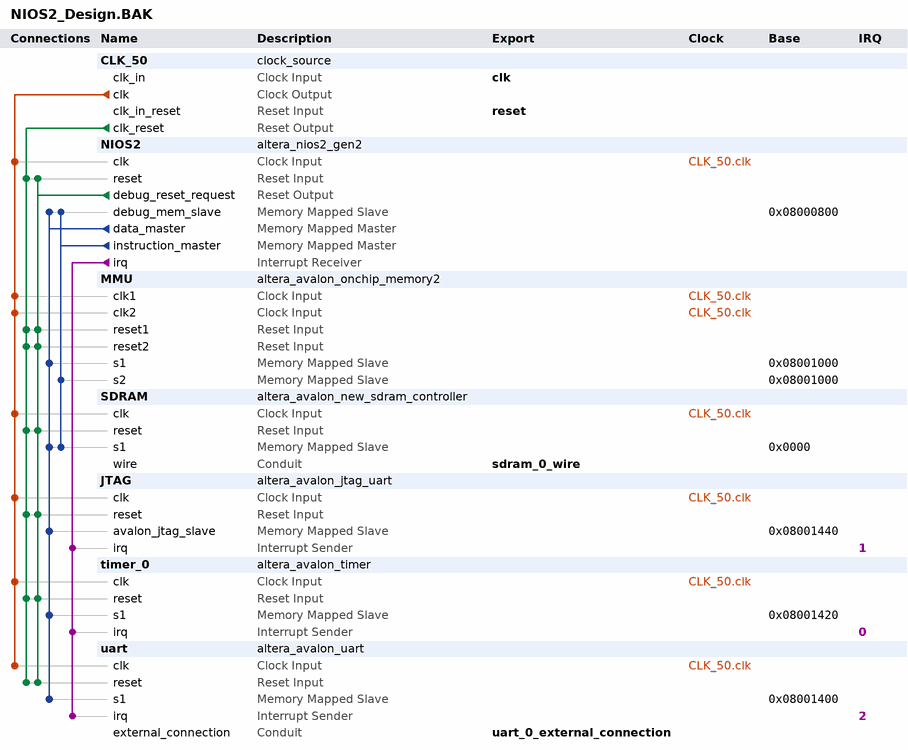
[diagram p0: system contents]
# Platform Designer (Qsys) system NIOS2_Design.BAK, Cyclone IV E EP4CE115F29C7
# Parameters at their usual value, and those the tool derives, are not listed.
package require -exact qsys 18.0
create_system NIOS2_Design.BAK
set_project_property DEVICE_FAMILY {Cyclone IV E}
set_project_property DEVICE EP4CE115F29C7

add_instance CLK_50 clock_source 18.0
set_instance_parameter_value CLK_50 clockFrequency 50000000

add_instance NIOS2 altera_nios2_gen2 18.0
set_instance_parameter_value NIOS2 dcache_size 2048
set_instance_parameter_value NIOS2 exceptionSlave SDRAM.s1
set_instance_parameter_value NIOS2 icache_size 4096
set_instance_parameter_value NIOS2 impl Fast
set_instance_parameter_value NIOS2 mmu_TLBMissExcSlave MMU.s2
set_instance_parameter_value NIOS2 mmu_enabled true
set_instance_parameter_value NIOS2 resetSlave SDRAM.s1

add_instance MMU altera_avalon_onchip_memory2 18.0
set_instance_parameter_value MMU dataWidth 32
set_instance_parameter_value MMU dualPort true
set_instance_parameter_value MMU initMemContent true
set_instance_parameter_value MMU initializationFileName onchip_mem.hex
set_instance_parameter_value MMU memorySize 1024

add_instance SDRAM altera_avalon_new_sdram_controller 18.0
set_instance_parameter_value SDRAM TAC 5.5
set_instance_parameter_value SDRAM TRCD 20.0
set_instance_parameter_value SDRAM TRP 20.0
set_instance_parameter_value SDRAM casLatency 3
set_instance_parameter_value SDRAM columnWidth 10
set_instance_parameter_value SDRAM dataWidth 32
set_instance_parameter_value SDRAM generateSimulationModel false
set_instance_parameter_value SDRAM model single_Micron_MT48LC4M32B2_7_chip
set_instance_parameter_value SDRAM numberOfBanks 4
set_instance_parameter_value SDRAM numberOfChipSelects 1
set_instance_parameter_value SDRAM powerUpDelay 100.0
set_instance_parameter_value SDRAM refreshPeriod 15.625
set_instance_parameter_value SDRAM rowWidth 13

add_instance JTAG altera_avalon_jtag_uart 18.0
set_instance_parameter_value JTAG simInteractiveOptions NO_INTERACTIVE_WINDOWS

add_instance timer_0 altera_avalon_timer 18.0
set_instance_parameter_value timer_0 period 1
set_instance_parameter_value timer_0 periodUnits MSEC

add_instance uart altera_avalon_uart 18.0
set_instance_parameter_value uart baud 115200
set_instance_parameter_value uart dataBits 8
set_instance_parameter_value uart fixedBaud true
set_instance_parameter_value uart parity NONE
set_instance_parameter_value uart stopBits 1

# connections
add_connection CLK_50.clk JTAG.clk clock
add_connection CLK_50.clk MMU.clk1 clock
add_connection CLK_50.clk MMU.clk2 clock
add_connection CLK_50.clk NIOS2.clk clock
add_connection CLK_50.clk SDRAM.clk clock
add_connection CLK_50.clk timer_0.clk clock
add_connection CLK_50.clk uart.clk clock
add_connection CLK_50.clk_reset JTAG.reset reset
add_connection CLK_50.clk_reset MMU.reset1 reset
add_connection CLK_50.clk_reset MMU.reset2 reset
add_connection CLK_50.clk_reset NIOS2.reset reset
add_connection CLK_50.clk_reset SDRAM.reset reset
add_connection CLK_50.clk_reset timer_0.reset reset
add_connection CLK_50.clk_reset uart.reset reset
add_connection NIOS2.debug_reset_request JTAG.reset reset
add_connection NIOS2.debug_reset_request MMU.reset1 reset
add_connection NIOS2.debug_reset_request MMU.reset2 reset
add_connection NIOS2.debug_reset_request NIOS2.reset reset
add_connection NIOS2.debug_reset_request SDRAM.reset reset
add_connection NIOS2.debug_reset_request timer_0.reset reset
add_connection NIOS2.debug_reset_request uart.reset reset
add_connection NIOS2.data_master JTAG.avalon_jtag_slave avalon
set_connection_parameter_value NIOS2.data_master/JTAG.avalon_jtag_slave baseAddress 0x08001440
add_connection NIOS2.data_master MMU.s1 avalon
set_connection_parameter_value NIOS2.data_master/MMU.s1 baseAddress 0x08001000
add_connection NIOS2.data_master NIOS2.debug_mem_slave avalon
set_connection_parameter_value NIOS2.data_master/NIOS2.debug_mem_slave baseAddress 0x08000800
add_connection NIOS2.data_master SDRAM.s1 avalon
set_connection_parameter_value NIOS2.data_master/SDRAM.s1 baseAddress 0x0000
add_connection NIOS2.data_master timer_0.s1 avalon
set_connection_parameter_value NIOS2.data_master/timer_0.s1 baseAddress 0x08001420
add_connection NIOS2.data_master uart.s1 avalon
set_connection_parameter_value NIOS2.data_master/uart.s1 baseAddress 0x08001400
add_connection NIOS2.instruction_master MMU.s2 avalon
set_connection_parameter_value NIOS2.instruction_master/MMU.s2 baseAddress 0x08001000
add_connection NIOS2.instruction_master NIOS2.debug_mem_slave avalon
set_connection_parameter_value NIOS2.instruction_master/NIOS2.debug_mem_slave baseAddress 0x08000800
add_connection NIOS2.instruction_master SDRAM.s1 avalon
set_connection_parameter_value NIOS2.instruction_master/SDRAM.s1 baseAddress 0x0000
add_connection NIOS2.irq JTAG.irq interrupt
set_connection_parameter_value NIOS2.irq/JTAG.irq irqNumber 1
add_connection NIOS2.irq timer_0.irq interrupt
set_connection_parameter_value NIOS2.irq/timer_0.irq irqNumber 0
add_connection NIOS2.irq uart.irq interrupt
set_connection_parameter_value NIOS2.irq/uart.irq irqNumber 2

# exported interfaces
add_interface clk clock sink
set_interface_property clk EXPORT_OF CLK_50.clk_in
add_interface reset reset sink
set_interface_property reset EXPORT_OF CLK_50.clk_in_reset
add_interface sdram_0_wire conduit end
set_interface_property sdram_0_wire EXPORT_OF SDRAM.wire
add_interface uart_0_external_connection conduit end
set_interface_property uart_0_external_connection EXPORT_OF uart.external_connection

set_interconnect_requirement {$system} qsys_mm.clockCrossingAdapter HANDSHAKE
set_interconnect_requirement {$system} qsys_mm.enableEccProtection FALSE
set_interconnect_requirement {$system} qsys_mm.insertDefaultSlave FALSE
set_interconnect_requirement {$system} qsys_mm.maxAdditionalLatency 1

save_system NIOS2_Design.BAK.qsys
